# Altium schematic sheet Encoders.SchDoc: Encoders
size A4; Engineer: Jason Zhou; DocumentNumber: 1; Revision: 0; SheetNumber: 6; SheetTotal: 6; Projectidentifier: V5 Co-proccessor
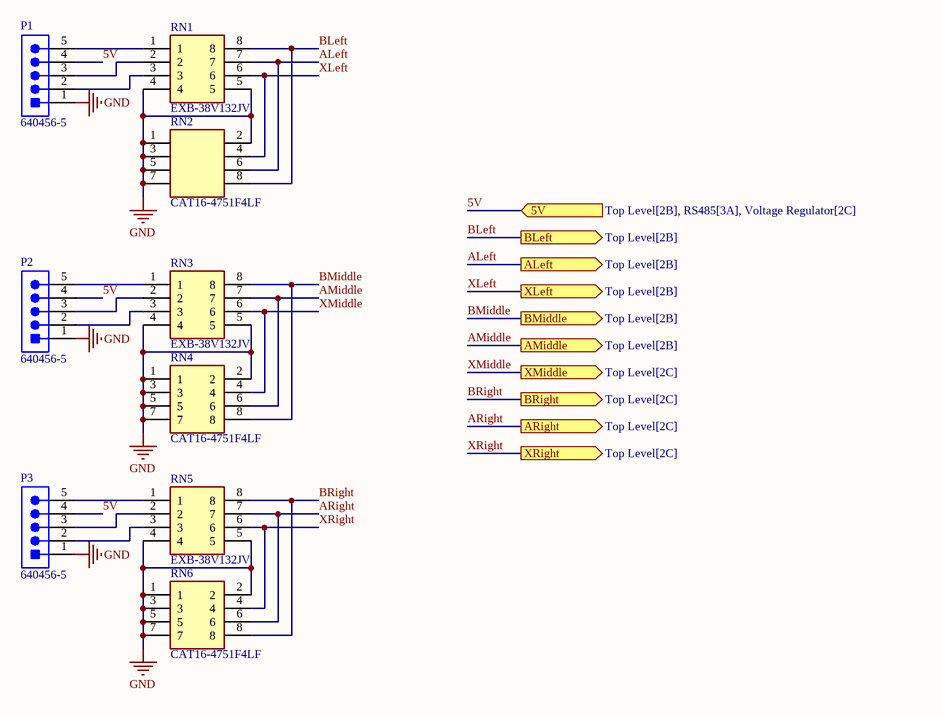
[diagram p0: Encoders.SchDoc]

## Parts
P1  640456-5  [TECO-640456-5]
P2  640456-5  [TECO-640456-5]
P3  640456-5  [TECO-640456-5]
RN1  EXB-38V132JV  [EXB38V132JV]
RN2  CAT16-4751F4LF  [CAPCAV80P155X320X60-8L]
RN3  EXB-38V132JV  [EXB38V132JV]
RN4  CAT16-4751F4LF  [CAPCAV80P155X320X60-8L]
RN5  EXB-38V132JV  [EXB38V132JV]
RN6  CAT16-4751F4LF  [CAPCAV80P155X320X60-8L]

## Ports
5V (in, see Top Level[2B], RS485[3A], Voltage Regulator[2C]), ALeft (out, see Top Level[2B]), AMiddle (out, see Top Level[2B]), ARight (out, see Top Level[2C]), BLeft (out, see Top Level[2B]), BMiddle (out, see Top Level[2B]), BRight (out, see Top Level[2C]), XLeft (out, see Top Level[2B]), XMiddle (out, see Top Level[2C]), XRight (out, see Top Level[2C])

## Nets
GND: P1.1(DTR) P2.1(DTR) P3.1(DTR) RN1.4 RN1.5 RN2.1 RN2.2 RN2.3 RN2.5 RN2.7 RN3.4 RN3.5 RN4.1 RN4.2 RN4.3 RN4.5 RN4.7 RN5.4 RN5.5 RN6.1 RN6.2 RN6.3 RN6.5 RN6.7
5V: P1.4(VCC) P2.4(VCC) P3.4(VCC) ; port 5V
ALeft: RN1.7 RN2.6 ; port ALeft
AMiddle: RN3.7 RN4.6 ; port AMiddle
ARight: RN5.7 RN6.6 ; port ARight
BLeft: RN1.8 RN2.8 ; port BLeft
BMiddle: RN3.8 RN4.8 ; port BMiddle
BRight: RN5.8 RN6.8 ; port BRight
XLeft: RN1.6 RN2.4 ; port XLeft
XMiddle: RN3.6 RN4.4 ; port XMiddle
XRight: RN5.6 RN6.4 ; port XRight
NetP1_2: P1.2(RXI) RN1.3
NetP1_3: P1.3(TXO) RN1.2
NetP1_5: P1.5(CTS) RN1.1
NetP2_2: P2.2(RXI) RN3.3
NetP2_3: P2.3(TXO) RN3.2
NetP2_5: P2.5(CTS) RN3.1
NetP3_2: P3.2(RXI) RN5.3
NetP3_3: P3.3(TXO) RN5.2
NetP3_5: P3.5(CTS) RN5.1

## Notes on the sheet
- Size:
- Date:
- Title
- A4
- Project:
- Time:
- Revision:
- Sheet
- of
- Engineer
- File:

## Library data of the parts
P1-P3 = CMP-1684-00014-1: Male Header, Pitch 2.54 mm, 1 x 5 Position, Height 10.03 mm, Tail Length 3.56 mm, / -55 to 105 degC, RoHS, Bulk; Manufacturer: TE Connectivity; Material, Housing: Polyester; Brand/Series: MTA-100Series; Color, Housing: White; Current, Rating: 5 / A; Temperature, Operating: -55to+105 / °C; Connector Type: MTA-100; Agency Approvals: CSA,UL; Material, Contact: CopperAlloy; Mounting Hole Size: 0.04 / "; Voltage, Rating: 250 / V; Contact Termination Area Plating: Tin; Pin Spacing: 0.1 / "; Primary Type: InterconnectSystem; Special Features: Pinstrip; Mount Angle: Vertical; Contact Centerline Spacing: 0.100 / in.; Number of Contacts: 5; Standards: RoHSCompliant,ELVCompliant,UL94V-0; Angle: Straight; Length, Terminal Post: 0.14 / in.; Manufacturer URL: http://www.te.com; Flammability Rating: UL94V-0; Mounting Type: PCMount; Termination: Solder; Package Reference: THD; Length, Overall: 0.5 / "; Contact Mating Area Plating: Tin; Length, Pin: 0.14 / "; Datasheet URL: http://sigma.octopart.com/77881742/technical_drawing/TE-Connectivity-640456-5.pdf; Package Description: Male Header, Pitch 2.54 mm, 1 x 5 Position, Height 10.03 mm, Tail Length 3.56 mm; Datasheet Version: Rev. W3; Contact Plating: Tin; Color: White; Number of Positions: 5; Type: PCBPlug; Contact Shape: Square; Number of Rows: 1; Size, Post: 0.025 / in.
RN1 RN3 RN5 = EXB-38V132JV: Resistor Network; Manufacturer_Name: Panasonic; Datasheet Link: https://industrial.panasonic.com/cdbs/www-data/pdf/AOC0000/AOC0000C14.pdf; Height: 0.6mm; Manufacturer_Part_Number: EXB-38V132JV; Mouser Part Number: 667-EXB-38V132JV; Mouser Price/Stock: https://www.mouser.co.uk/ProductDetail/Panasonic/EXB-38V132JV?qs=WwqriLBepZuuySSdwYXZFg%3D%3D
RN2 RN4 RN6 = CAT16-4751F4LF: Resistor Network; Manufacturer_Name: Bourns; Datasheet Link: http://www.bourns.com/docs/Product-Datasheets/cat16-j.pdf; Height: 0.6mm; Manufacturer_Part_Number: CAT16-4751F4LF; Mouser Part Number: 652-CAT16-4751F4LF; Mouser Price/Stock: https://www.mouser.co.uk/ProductDetail/Bourns/CAT16-4751F4LF?qs=vP03yYafZdFfyS1KGGbPOQ%3D%3D